# Altium schematic sheet USB_Programmer.SchDoc
size A3
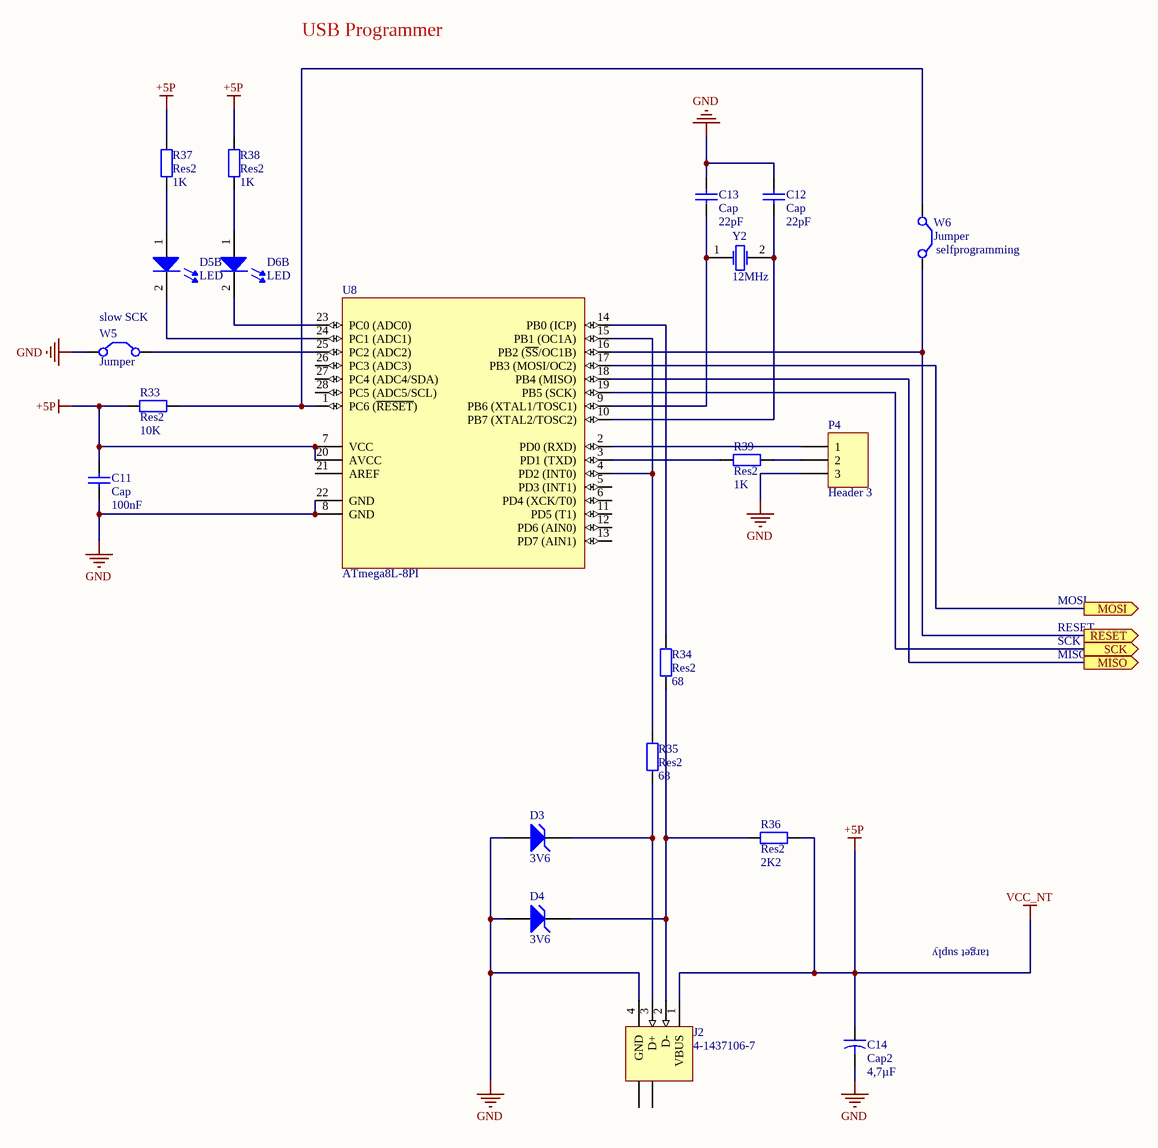
[diagram p0: USB_Programmer.SchDoc]

## Parts
C11  Cap  value 100nF  [RAD-0.1]
C12  Cap  value 22pF  [RAD-0.1]
C13  Cap  value 22pF  [RAD-0.1]
C14  Cap2  value 4,7µF  [CAPR5-4X5]
D3  3V6  [DO-7]
D4  3V6  [DO-7]
D5  LED  [LED 3mm]  (part B of 2)
D6  LED  [LED 3mm]  (part B of 2)
J2  4-1437106-7  [1437106]
P4  Header 3  [HDR1X3]
R33  Res2  value 10K  [AXIAL-0.4]
R34  Res2  value 68  [AXIAL-0.4]
R35  Res2  value 68  [AXIAL-0.4]
R36  Res2  value 2K2  [AXIAL-0.4]
R37  Res2  value 1K  [AXIAL-0.4]
R38  Res2  value 1K  [AXIAL-0.4]
R39  Res2  value 1K  [AXIAL-0.4]
U8  ATmega8L-8PI  [28P3]
W5  Jumper  [HDR1X2]
W6  Jumper  [HDR1X2]
Y2  12MHz  [Quarz HC49-4HL]

## Ports
MISO (out), MOSI (out), RESET (out), SCK (out)

## Nets
+5P: C11.2 C14.1 J2.1(VBUS) R33.1 R36.2 R37.2 R38.2 U8.7(VCC) U8.20(AVCC)  [also labelled VCC_NT]
GND: C11.1 C12.1 C13.1 C14.2 D3.1(A) D4.1(A) J2.4(GND) P4.3 U8.8(GND) U8.22(GND) W5.1(C1)
MISO: U8.18(PB4_(MISO)) ; port MISO
MOSI: U8.17(PB3_(MOSI/OC2)) ; port MOSI
RESET: U8.16(PB2_(~{SS}/OC1B)) W6.2(C2) ; port RESET
SCK: U8.19(PB5_(SCK)) ; port SCK
NetC12_2: C12.2 U8.10(PB7_(XTAL2/TOSC2)) Y2.2
NetC13_2: C13.2 U8.9(PB6_(XTAL1/TOSC1)) Y2.1
NetD3_2: D3.2(K) J2.3(D+) R35.2
NetD4_2: D4.2(K) J2.2(D-) R34.2 R36.1
NetD5_1: D5.1 R37.1
NetD5_2: D5.2 U8.24(PC1_(ADC1))
NetD6_1: D6.1 R38.1
NetD6_2: D6.2 U8.23(PC0_(ADC0))
NetP4_1: P4.1 U8.2(PD0_(RXD))
NetP4_2: P4.2 R39.2
NetR33_2: R33.2 U8.1(PC6_(~{RESET})) W6.1(C1)
NetR34_1: R34.1 U8.14(PB0_(ICP))
NetR35_1: R35.1 U8.4(PD2_(INT0)) U8.15(PB1_(OC1A))
NetR39_1: R39.1 U8.3(PD1_(TXD))
NetU8_25: U8.25(PC2_(ADC2)) W5.2(C2)

Not connected (* = marked no-connect by the designer): J2 5(SHLD) 6(SHLD); U8 5(PD3_(INT1)) 6(PD4_(XCK/T0)) 11(PD5_(T1)) 12(PD6_(AIN0)) 13(PD7_(AIN1)) 21(AREF) 26(PC3_(ADC3)) 27(PC4_(ADC4/SDA)) 28(PC5_(ADC5/SCL))

## Notes on the sheet
- USB Programmer
- (near W6) selfprogramming
- (near W5) slow SCK
- RESET
- MOSI
- MISO
- SCK
- target suply

## Library data of the parts
C11-C13 = Cap: Capacitor; Published: 8-Jun-2000; LatestRevisionDate: 17-Jul-2002; LatestRevisionNote: Re-released for DXP Platform.; PackageReference: RAD-0.3; Publisher: Altium Limited; PackageDescription: Radial Cap, Thru-Hole; 2 Leads; 0.3 in Pin Spacing
C14 = Cap2: Capacitor; Published: 23-Sep-2002; PackageReference: CAPR5-4X5; Publisher: Altium Limited; PackageDescription: Capacitor; 2 Leads
D3 D4 = D Zener: Zener Diode; Published: 8-Jun-2000; LatestRevisionDate: 17-Jul-2002; LatestRevisionNote: Re-released for DXP Platform.; PackageReference: DIODE-0.7; Publisher: Altium Limited; PackageDescription: Diode, Thru-Hole; 2 Leads; 0.7 in Pin Spacing
D5 D6 = LED Std: LED bedrahtet
J2 = 4-1437106-7: USB 1.1, Right Angle, Thru-Hole, B Type, Receptacle, 4 Position, White; ContactMaterial: Copper Alloy; ContactPlating: Gold (30); TerminationLength: 2.90mm [0.114in.]; PCB_Layout: Complies with manufacturer's recommendation.; DrillSize: Corresponds to nominal value.; PanelGround: Without; Published: 15-Jul-2004; DatasheetDocument: 05-Jan-2004; PackageDocument: 05-Jan-2004; PackageReference: 1437106; Publisher: Altium Limited; HousingMaterial: Glass-Filled Thermoplastic; ComponentLink1Description: Manufacturer Link; ComponentLink1URL: http://www.tycoelectronics.com/; ComponentLink2Description: Packaging Specification; ComponentLink2URL: http://ecommas.tycoelectronics.com/commerce/DocumentDelivery/DDEController?Action=showdoc&DocId=Customer+Drawing%7F1437106%7FC%7Ftif%7FEnglish%7FENG_CD_1437106_C.tif
P4 = Header 3: Header, 3-Pin; LatestRevisionDate: 17-Jul-2002; LatestRevisionNote: Re-released for DXP Platform.; Publisher: Altium Limited
R33-R39 = Res2: Resistor; Published: 8-Jun-2000; LatestRevisionDate: 17-Jul-2002; LatestRevisionNote: Re-released for DXP Platform.; PackageReference: AXIAL-0.4; Publisher: Altium Limited; PackageDescription: Axial Device, Thru-Hole; 2 Leads; 0.4 in Pin Spacing
U8 = ATmega8L-8PI: 8-Bit AVR Microcontroller with 8K Bytes of In-System Programmable Flash Memory; Published: 17-Sep-2003; LatestRevisionDate: 04-Mar-2005; LatestRevisionNote: Stylized 3D Model Added.; DatasheetVersion: 2486H-AVR-09/02; PackageVersion: revB, Sep-2001; PackageReference: 28P3; Publisher: Altium Limited; PackageDescription: DIP; 28 Leads; Row Spacing 7.62 mm; Pitch 2.54 mm; ComponentLink1Description: Manufacturer Link; ComponentLink1URL: http://www.atmel.com; ComponentLink2Description: Datasheet; ComponentLink2URL: http://www.atmel.com/dyn/resources/prod_documents/doc2486.pdf
W5 W6 = Jumper: Jumper Wire; Published: 24-Mar-1999; LatestRevisionDate: 17-Jul-2002; LatestRevisionNote: Re-released for DXP Platform.; PackageReference: RAD-0.2; Publisher: Altium Limited; PackageDescription: Radial Cap, Thru-Hole; 2 Leads; 0.2 in Pin Spacing
Y2 = Quarz HC49-4HL